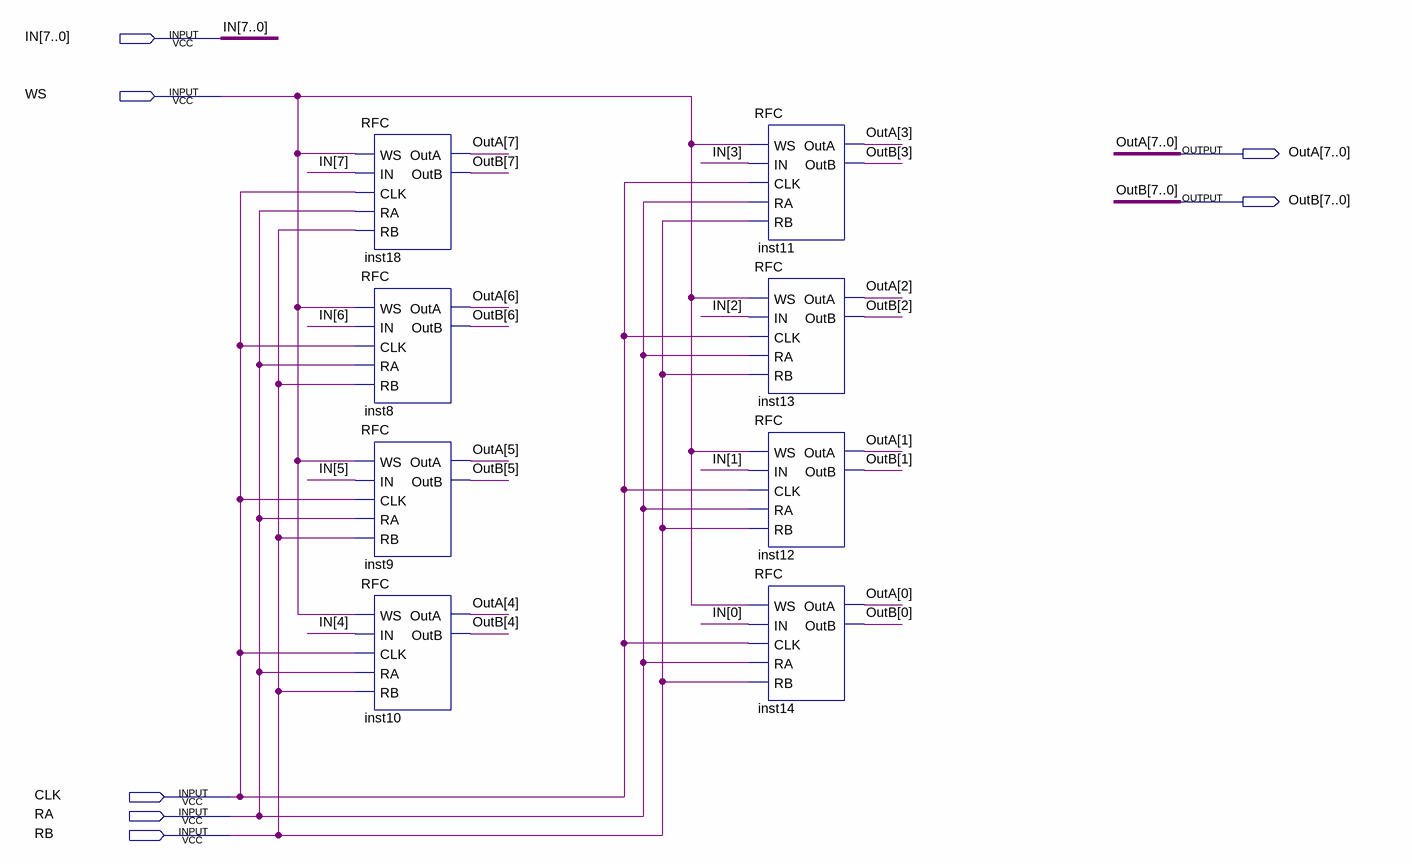
[diagram p0: schematic sheet]
// Quartus schematic RFC8.bdf as structural Verilog: 8 symbols, 7 pins
module RFC8 (
  input  [7:0] IN,
  input  WS,
  input  CLK,
  input  RA,
  input  RB,
  output [7:0] OutA,
  output [7:0] OutB
);

  RFC inst18 (.WS(WS), .IN(IN[7]), .CLK(CLK), .RA(RA), .RB(RB), .OutA(OutA[7]), .OutB(OutB[7]));
  RFC inst8 (.WS(WS), .IN(IN[6]), .CLK(CLK), .RA(RA), .RB(RB), .OutA(OutA[6]), .OutB(OutB[6]));
  RFC inst9 (.WS(WS), .IN(IN[5]), .CLK(CLK), .RA(RA), .RB(RB), .OutA(OutA[5]), .OutB(OutB[5]));
  RFC inst10 (.WS(WS), .IN(IN[4]), .CLK(CLK), .RA(RA), .RB(RB), .OutA(OutA[4]), .OutB(OutB[4]));
  RFC inst11 (.WS(WS), .IN(IN[3]), .CLK(CLK), .RA(RA), .RB(RB), .OutA(OutA[3]), .OutB(OutB[3]));
  RFC inst13 (.WS(WS), .IN(IN[2]), .CLK(CLK), .RA(RA), .RB(RB), .OutA(OutA[2]), .OutB(OutB[2]));
  RFC inst12 (.WS(WS), .IN(IN[1]), .CLK(CLK), .RA(RA), .RB(RB), .OutA(OutA[1]), .OutB(OutB[1]));
  RFC inst14 (.WS(WS), .IN(IN[0]), .CLK(CLK), .RA(RA), .RB(RB), .OutA(OutA[0]), .OutB(OutB[0]));
endmodule
